# Altium schematic sheet 01_XDRONE.SchDoc: XDRONE
size A4; Author: Gabriel; Organization: Altium Limited; Address1: L3, 12a Rodborough Rd; Address2: Frenchs Forest; Address3: NSW; Address4: Australia 2086; SheetNumber: 1; SheetTotal: 1; Subtitle: Main
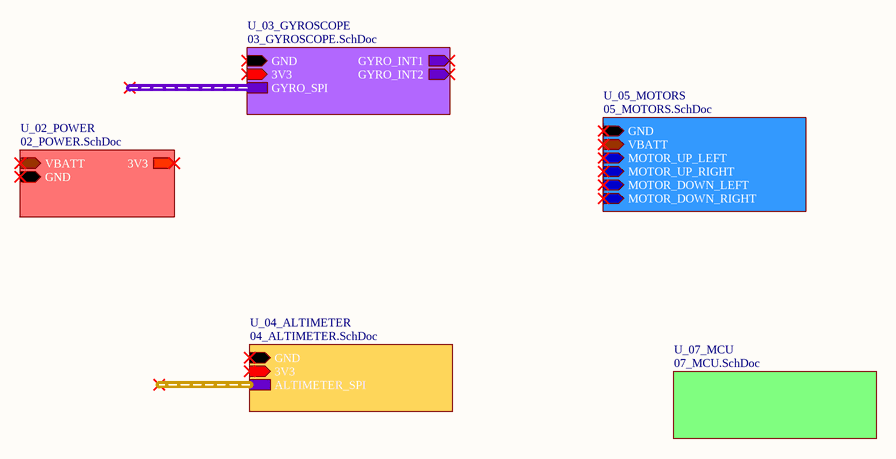
[diagram p0: 01_XDRONE.SchDoc]

## Sub-sheets
U_02_POWER = 02_POWER.SchDoc: VBATT (in), GND (in), 3V3 (out)
U_03_GYROSCOPE = 03_GYROSCOPE.SchDoc: GND (in), 3V3 (in), GYRO_INT1 (out), GYRO_INT2 (out), GYRO_SPI (harness GYRO_SPI)
U_04_ALTIMETER = 04_ALTIMETER.SchDoc: GND (in), 3V3 (in), ALTIMETER_SPI (harness ALTIMETER_SPI)
U_05_MOTORS = 05_MOTORS.SchDoc: GND (in), VBATT (in), MOTOR_UP_LEFT (in), MOTOR_UP_RIGHT (in), MOTOR_DOWN_LEFT (in), MOTOR_DOWN_RIGHT (in)
U_07_MCU = 07_MCU.SchDoc: no entries

## Notes on the sheet
- TITLE:
- CREATED BY
- MODIFIED DATE
- PAGE
- /